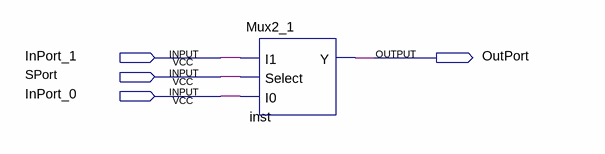
[diagram p0: schematic sheet]
// Quartus schematic MuxDemo.bdf as structural Verilog: 1 symbols, 4 pins
module MuxDemo (
  input  InPort_1,
  input  SPort,
  input  InPort_0,
  output OutPort
);

  Mux2_1 inst (.I1(InPort_1), .Select(SPort), .I0(InPort_0), .Y(OutPort));
endmodule
